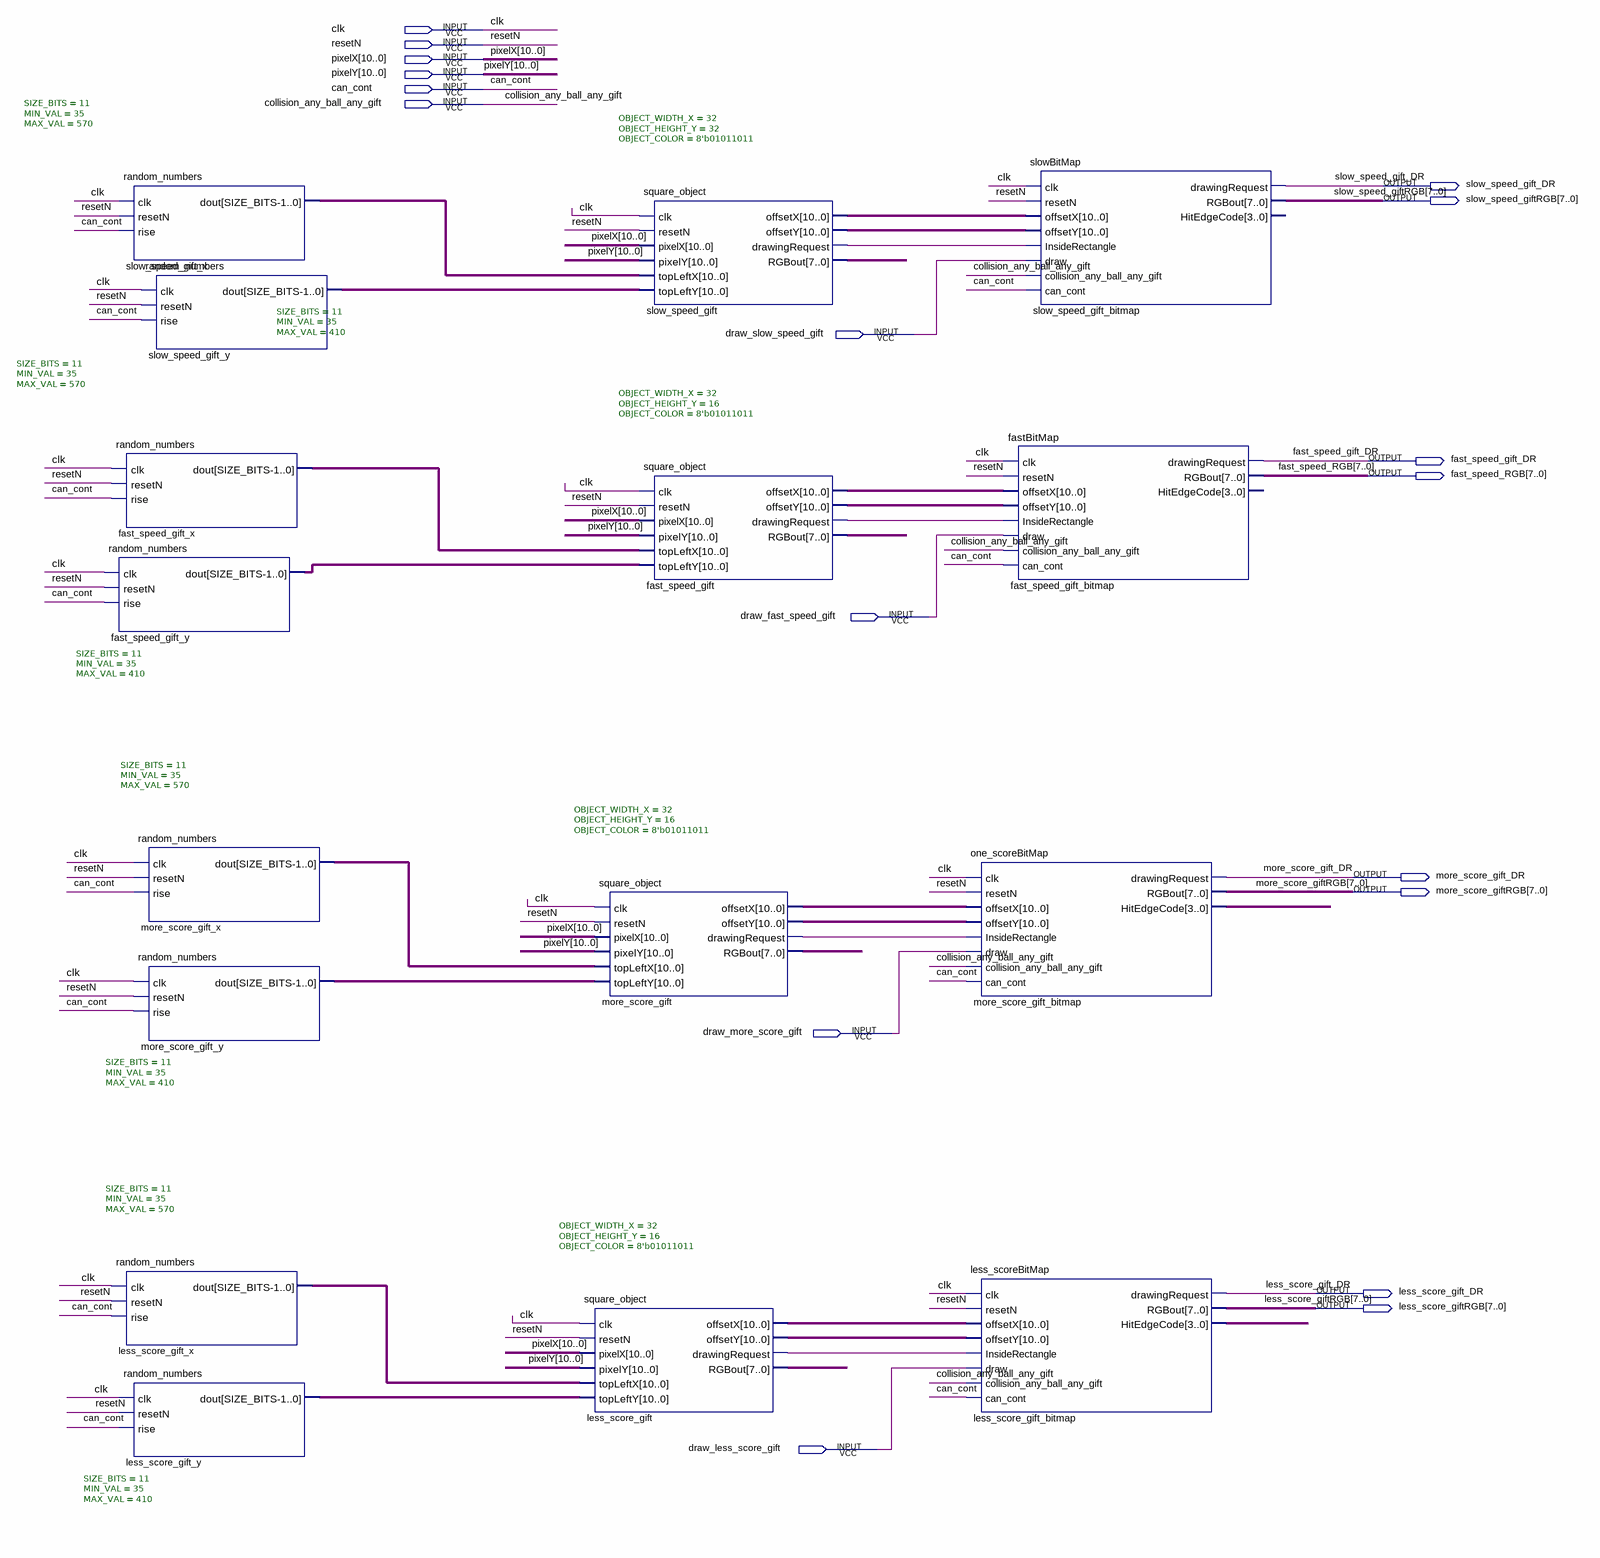
[diagram p0: schematic sheet]
// Quartus schematic gift_block.bdf as structural Verilog: 16 symbols, 18 pins
module gift_block (
  input  clk,
  input  resetN,
  input  [10:0] pixelX,
  input  [10:0] pixelY,
  input  can_cont,
  input  collision_any_ball_any_gift,
  input  draw_slow_speed_gift,
  input  draw_fast_speed_gift,
  input  draw_more_score_gift,
  input  draw_less_score_gift,
  output slow_speed_gift_DR,
  output [7:0] slow_speed_giftRGB,
  output fast_speed_gift_DR,
  output [7:0] fast_speed_RGB,
  output more_score_gift_DR,
  output [7:0] more_score_giftRGB,
  output less_score_gift_DR,
  output [7:0] less_score_giftRGB
);

  wire fast_speed_gift_drawingrequest, less_score_gift_drawingrequest, more_score_gift_drawingrequest,
       slow_speed_gift_drawingrequest;
  wire [3:0] less_score_gift_bitmap_hitedgecode, more_score_gift_bitmap_hitedgecode;
  wire [7:0] fast_speed_gift_rgbout, less_score_gift_rgbout, more_score_gift_rgbout, slow_speed_gift_rgbout;
  wire [10:0] fast_speed_gift_offsetx, fast_speed_gift_offsety, fast_speed_gift_x_dout,
       fast_speed_gift_y_dout, less_score_gift_offsetx, less_score_gift_offsety, less_score_gift_x_dout,
       less_score_gift_y_dout, more_score_gift_offsetx, more_score_gift_offsety, more_score_gift_x_dout,
       more_score_gift_y_dout, slow_speed_gift_offsetx, slow_speed_gift_offsety, slow_speed_gift_x_dout,
       slow_speed_gift_y_dout;

  random_numbers #(.SIZE_BITS(11), .MIN_VAL(35), .MAX_VAL(570)) slow_speed_gift_x (
    .clk(clk), .resetN(resetN), .rise(can_cont), .dout(slow_speed_gift_x_dout));
  random_numbers #(.SIZE_BITS(11), .MIN_VAL(35), .MAX_VAL(410)) slow_speed_gift_y (
    .clk(clk), .resetN(resetN), .rise(can_cont), .dout(slow_speed_gift_y_dout));
  random_numbers #(.SIZE_BITS(11), .MIN_VAL(35), .MAX_VAL(570)) fast_speed_gift_x (
    .clk(clk), .resetN(resetN), .rise(can_cont), .dout(fast_speed_gift_x_dout));
  random_numbers #(.SIZE_BITS(11), .MIN_VAL(35), .MAX_VAL(410)) fast_speed_gift_y (
    .clk(clk), .resetN(resetN), .rise(can_cont), .dout(fast_speed_gift_y_dout));
  random_numbers #(.SIZE_BITS(11), .MIN_VAL(35), .MAX_VAL(570)) more_score_gift_x (
    .clk(clk), .resetN(resetN), .rise(can_cont), .dout(more_score_gift_x_dout));
  random_numbers #(.SIZE_BITS(11), .MIN_VAL(35), .MAX_VAL(410)) more_score_gift_y (
    .clk(clk), .resetN(resetN), .rise(can_cont), .dout(more_score_gift_y_dout));
  random_numbers #(.SIZE_BITS(11), .MIN_VAL(35), .MAX_VAL(570)) less_score_gift_x (
    .clk(clk), .resetN(resetN), .rise(can_cont), .dout(less_score_gift_x_dout));
  random_numbers #(.SIZE_BITS(11), .MIN_VAL(35), .MAX_VAL(410)) less_score_gift_y (
    .clk(clk), .resetN(resetN), .rise(can_cont), .dout(less_score_gift_y_dout));
  square_object #(.OBJECT_WIDTH_X(32), .OBJECT_HEIGHT_Y(16), .OBJECT_COLOR(8'b01011011)) more_score_gift (
    .clk(clk), .resetN(resetN), .pixelX(pixelX), .pixelY(pixelY), .topLeftX(more_score_gift_x_dout),
    .topLeftY(more_score_gift_y_dout), .offsetX(more_score_gift_offsetx), .offsetY(more_score_gift_offsety),
    .drawingRequest(more_score_gift_drawingrequest), .RGBout(more_score_gift_rgbout));
  square_object #(.OBJECT_WIDTH_X(32), .OBJECT_HEIGHT_Y(16), .OBJECT_COLOR(8'b01011011)) less_score_gift (
    .clk(clk), .resetN(resetN), .pixelX(pixelX), .pixelY(pixelY), .topLeftX(less_score_gift_x_dout),
    .topLeftY(less_score_gift_y_dout), .offsetX(less_score_gift_offsetx), .offsetY(less_score_gift_offsety),
    .drawingRequest(less_score_gift_drawingrequest), .RGBout(less_score_gift_rgbout));
  square_object #(.OBJECT_WIDTH_X(32), .OBJECT_HEIGHT_Y(32), .OBJECT_COLOR(8'b01011011)) slow_speed_gift (
    .clk(clk), .resetN(resetN), .pixelX(pixelX), .pixelY(pixelY), .topLeftX(slow_speed_gift_x_dout),
    .topLeftY(slow_speed_gift_y_dout), .offsetX(slow_speed_gift_offsetx), .offsetY(slow_speed_gift_offsety),
    .drawingRequest(slow_speed_gift_drawingrequest), .RGBout(slow_speed_gift_rgbout));
  square_object #(.OBJECT_WIDTH_X(32), .OBJECT_HEIGHT_Y(16), .OBJECT_COLOR(8'b01011011)) fast_speed_gift (
    .clk(clk), .resetN(resetN), .pixelX(pixelX), .pixelY(pixelY), .topLeftX(fast_speed_gift_x_dout),
    .topLeftY(fast_speed_gift_y_dout), .offsetX(fast_speed_gift_offsetx), .offsetY(fast_speed_gift_offsety),
    .drawingRequest(fast_speed_gift_drawingrequest), .RGBout(fast_speed_gift_rgbout));
  one_scoreBitMap more_score_gift_bitmap (
    .clk(clk), .resetN(resetN), .offsetX(more_score_gift_offsetx), .offsetY(more_score_gift_offsety),
    .InsideRectangle(more_score_gift_drawingrequest), .draw(draw_more_score_gift),
    .collision_any_ball_any_gift(collision_any_ball_any_gift), .can_cont(can_cont),
    .drawingRequest(more_score_gift_DR), .RGBout(more_score_giftRGB),
    .HitEdgeCode(more_score_gift_bitmap_hitedgecode));
  less_scoreBitMap less_score_gift_bitmap (
    .clk(clk), .resetN(resetN), .offsetX(less_score_gift_offsetx), .offsetY(less_score_gift_offsety),
    .InsideRectangle(less_score_gift_drawingrequest), .draw(draw_less_score_gift),
    .collision_any_ball_any_gift(collision_any_ball_any_gift), .can_cont(can_cont),
    .drawingRequest(less_score_gift_DR), .RGBout(less_score_giftRGB),
    .HitEdgeCode(less_score_gift_bitmap_hitedgecode));
  slowBitMap slow_speed_gift_bitmap (
    .clk(clk), .resetN(resetN), .offsetX(slow_speed_gift_offsetx), .offsetY(slow_speed_gift_offsety),
    .InsideRectangle(slow_speed_gift_drawingrequest), .draw(draw_slow_speed_gift),
    .collision_any_ball_any_gift(collision_any_ball_any_gift), .can_cont(can_cont),
    .drawingRequest(slow_speed_gift_DR), .RGBout(slow_speed_giftRGB));  // open: HitEdgeCode
  fastBitMap fast_speed_gift_bitmap (
    .clk(clk), .resetN(resetN), .offsetX(fast_speed_gift_offsetx), .offsetY(fast_speed_gift_offsety),
    .InsideRectangle(fast_speed_gift_drawingrequest), .draw(draw_fast_speed_gift),
    .collision_any_ball_any_gift(collision_any_ball_any_gift), .can_cont(can_cont),
    .drawingRequest(fast_speed_gift_DR), .RGBout(fast_speed_RGB));  // open: HitEdgeCode
endmodule
